# EAGLE design L80_Breakout (EAGLE 9.6.2)
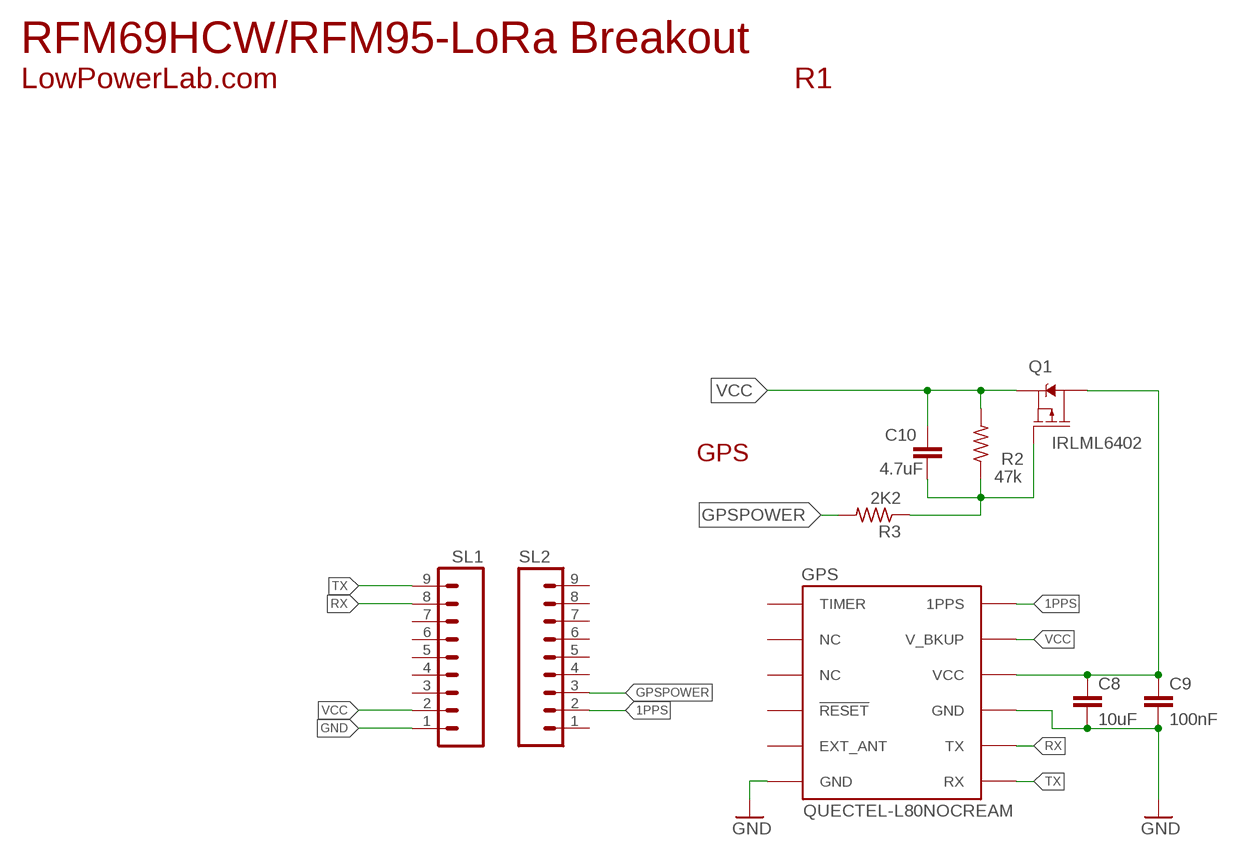
[diagram p0: schematic, sheet 1]

## Parts
C8  10uF  CAPC0603-THINCREAM  [C0603-THINCREAM]
C9  100nF  CAPC0603-THINCREAM  [C0603-THINCREAM]
C10  4.7uF  CAPC0603-THINCREAM  [C0603-THINCREAM]
GPS  QUECTEL-L80NOCREAM  [QUECTEL-L80-NOCREAM]
Q1  IRLML6402  MOSFET_PCH-IRLML6402  [SOT23-3]
R2  47k  R-USR0603-THINCREAM  [R0603-THINCREAM]
R3  2K2  R-USR0603-THINCREAM  [R0603-THINCREAM]
SL1  M09  [09P]
SL2  M09  [09P]

## Nets
1PPS: GPS.6(1PPS) SL2.2
GND: C8.2 C9.2 GPS.3(GND) GPS.12(GND) SL1.1
GPSPOWER: R3.2 SL2.3
N$7: C8.1 C9.1 GPS.4(VCC) Q1.3(D)
N$8: C10.2 Q1.1(G) R2.1 R3.1
RX: GPS.2(TX) SL1.8
TX: GPS.1(RX) SL1.9
VCC: C10.1 GPS.5(V_BKUP) Q1.2(S) R2.2 SL1.2
Unconnected: GPS.7(TIMER) GPS.8(NC) GPS.9(NC) GPS.10(!RESET) GPS.11(EXT_ANT) SL1.3 SL1.4 SL1.5 SL1.6 SL1.7 SL2.1 SL2.4 SL2.5 SL2.6 SL2.7 SL2.8 SL2.9

## Notes on the sheet
- RFM69HCW/RFM95-LoRa Breakout
- LowPowerLab.com | R1
- GPS

## Library data of the parts
C8 C10 = nootropicdesign:CAP: Unpolarized capacitor; OC_FARNELL: unknown
C9 = nootropicdesign:CAP: Unpolarized capacitor; MF: AVX; MPN: 02016D104KAT2A; OC_FARNELL: 1657913
GPS = quectel:QUECTEL-L80: Description: L80 is an ultra slim GPS POT (Patch on Top) module with an embedded 15.0 × 15.0 × 4.0mm patch antenna. This space-saving design makes L80 become the perpect module for the miniature devices. Adopted by LCC package and integrated with patch antenna, L80 has exceptional performance both in acquisition and tracking. Combining advanced AGPS called EASY™ (Embedded Assist System) and proven AlwaysLocate™ technology.; OC_FARNELL: unknown
Q1 = ianc:MOSFET_PCH: P-channel MOSFETs Voltage controlled devices that allow control of high current outputs. 3.7A/20V/65mΩ SparkFun Products: SparkFun ESP32 Thing <https://www.sparkfun.com/products/13907> SparkFun ESP8266 Thing <https://www.sparkfun.com/products/13231>; OC_FARNELL: unknown; PROD_ID: IRLML6402TRPBF
R2 R3 = nootropicdesign:R-US: Resistor; OC_FARNELL: unknown
SL1 SL2 = con-amp-quick:M09: AMP QUICK CONNECTOR; OC_FARNELL: unknown; OC_NEWARK: unknown

## Net classes
0 default: width 0 mm, drill 0 mm
1 power: width 0.381 mm, clearance 0.254 mm

## Board
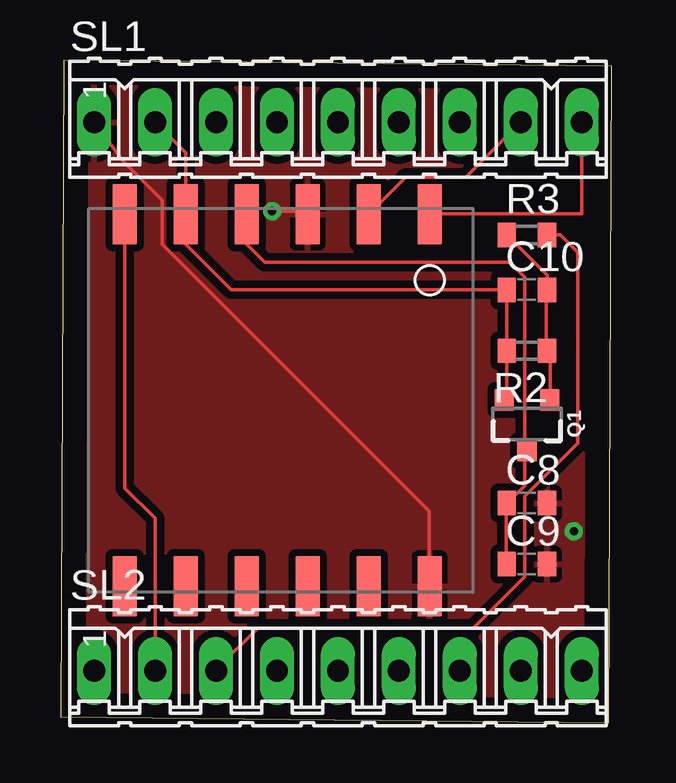
[diagram p1: board, top side]
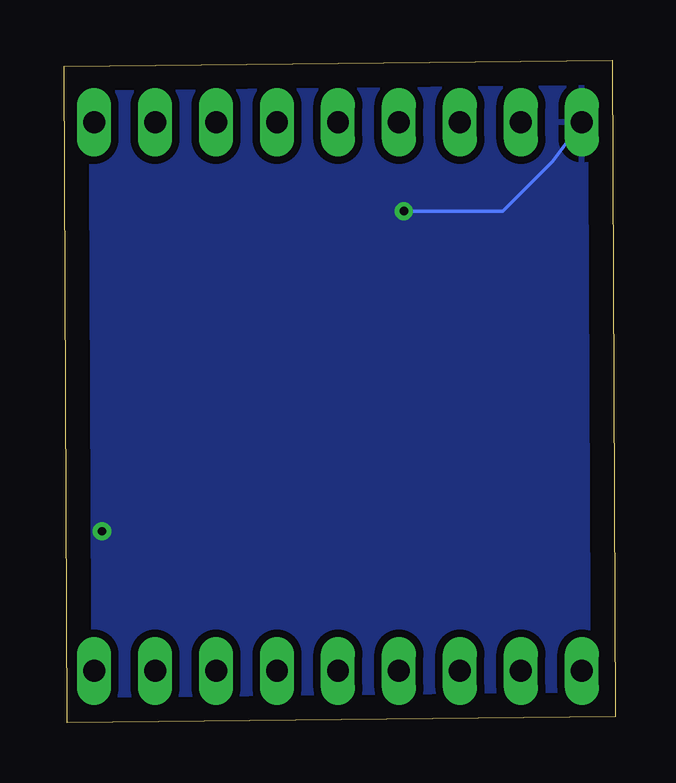
[diagram p2: board, bottom side, seen from below]

Size 22.97 x 27.61 mm. Coordinates in mm from the lower left corner, seen from the top.
Outline: 0,0.25 22.84,0 22.97,27.36 0.13,27.61 0,0.25
Copper layers (1*16): Top 0.035mm / dielectric 1.5mm / Bottom 0.035mm
Design rules "default": minimum track width 6mil, minimum drill 0.35mm, track to track 6mil, track to pad 6mil, pad to pad 6mil, via to via 6mil, smd to smd 6mil, copper to edge 40mil, drill to drill 6mil, minimum pad ring 10mil, minimum via ring 8mil, stop-mask expansion 4mil, vias tented up to drill 0mil, thermal gap 10mil

### Footprints (pad centres in the part's own frame; a part is rotated, then mirrored left to right if it is on the bottom)
C0603-THINCREAM = smd 0.762 x 1.016: 1 -0.838,0; 2 0.838,0
QUECTEL-L80-NOCREAM = smd 2.5 x 1: 1 17.75,3.8; 2 17.75,6.34; 3 17.75,8.88; 4 17.75,11.42; 5 17.75,13.96; 6 17.75,16.5; 7 2.25,16.5; 8 2.25,13.96; 9 2.25,11.42; 10 2.25,8.88; 11 2.25,6.34; 12 2.25,3.8
SOT23-3 = smd 0.8 x 0.9: 1 -0.95,-1; 2 0.95,-1; 3 0,1.1
R0603-THINCREAM = smd 0.762 x 1.016: 1 -0.838,0; 2 0.838,0
09P = drill 0.914 long: 1 -10.16,0; 2 -7.62,0; 3 -5.08,0; 4 -2.54,0; 5 0,0; 6 2.54,0; 7 5.08,0; 8 7.62,0; 9 10.16,0

### Placement (x,y rotation side)
C8  19.43,9.14 0 top
C9  19.43,6.6 0 top
C10  19.43,18.03 0 top
GPS  19.18,3.43 90 top
Q1  19.43,12.45 180 top
R2  19.43,15.49 180 top
R3  19.43,20.32 0 top
SL1  11.56,25.02 0 top
SL2  11.56,2.16 0 top

### Tracks (layer width: path | path; a pad name or v marks a point on that pad's centre or on a via)
1PPS
  Top 0.152: GPS.6 2.68,9.77 3.94,8.51 SL2.2
GND  (via drill 0.35)
  Top 0.152: GPS.12 15.37,5.77 15.37,8.81 4.24,19.94 4.24,21.77 2.62,23.39 SL1.1 | v8.81,21.31 10.19,21.31 GPS.3
  Bottom 0.152: v8.81,21.31 4.7,21.31 2.62,23.39 SL1.1
  other vias: 21.39,7.98
  pour Top (isolate 0.305): 22.99,-0.38 22.99,27.56 0.13,27.56 0.13,-0.38
  pour Bottom (isolate 0.305): 0.13,27.56 22.99,27.56 22.99,-0.38 0.13,-0.38
GPSPOWER
  Top 0.152: SL2.3 6.53,2.26 8.2,3.94 17.2,3.94 19.33,6.07 19.33,9.42 21.54,11.63 21.54,19.61 20.83,20.32 R3.2
N$7
  Top 0.152: GPS.4 7.76,19.93 8.51,19.18 18.72,19.18 19.33,18.57 19.33,11.4 Q1.3 19.33,11.25 19.33,9.88 C8.1 18.57,9.12 18.57,6.68 C9.1
N$8
  Top 0.152: 20.4,15.06 20.4,15.37 R2.1 | 20.4,15.06 20.4,13.54 Q1.1 | 20.4,15.06 R2.1 | R2.1 20.24,15.52 20.24,17.96 C10.2 20.27,18.64 R3.1
RX
  Top 0.152: GPS.2 14.39,22.73 16.89,22.73 SL1.8
TX
  Top 0.152: GPS.1 15.41,21.21 21.72,21.21 SL1.9
VCC
  Top 0.152: SL1.2 5.22,23.74 GPS.5 5.22,19.93 7.11,18.03 C10.1 R2.2 18.59,13.56 Q1.2